# Altium schematic sheet INT_REG.SchDoc
size A; SheetNumber: 4; SheetTotal: 11
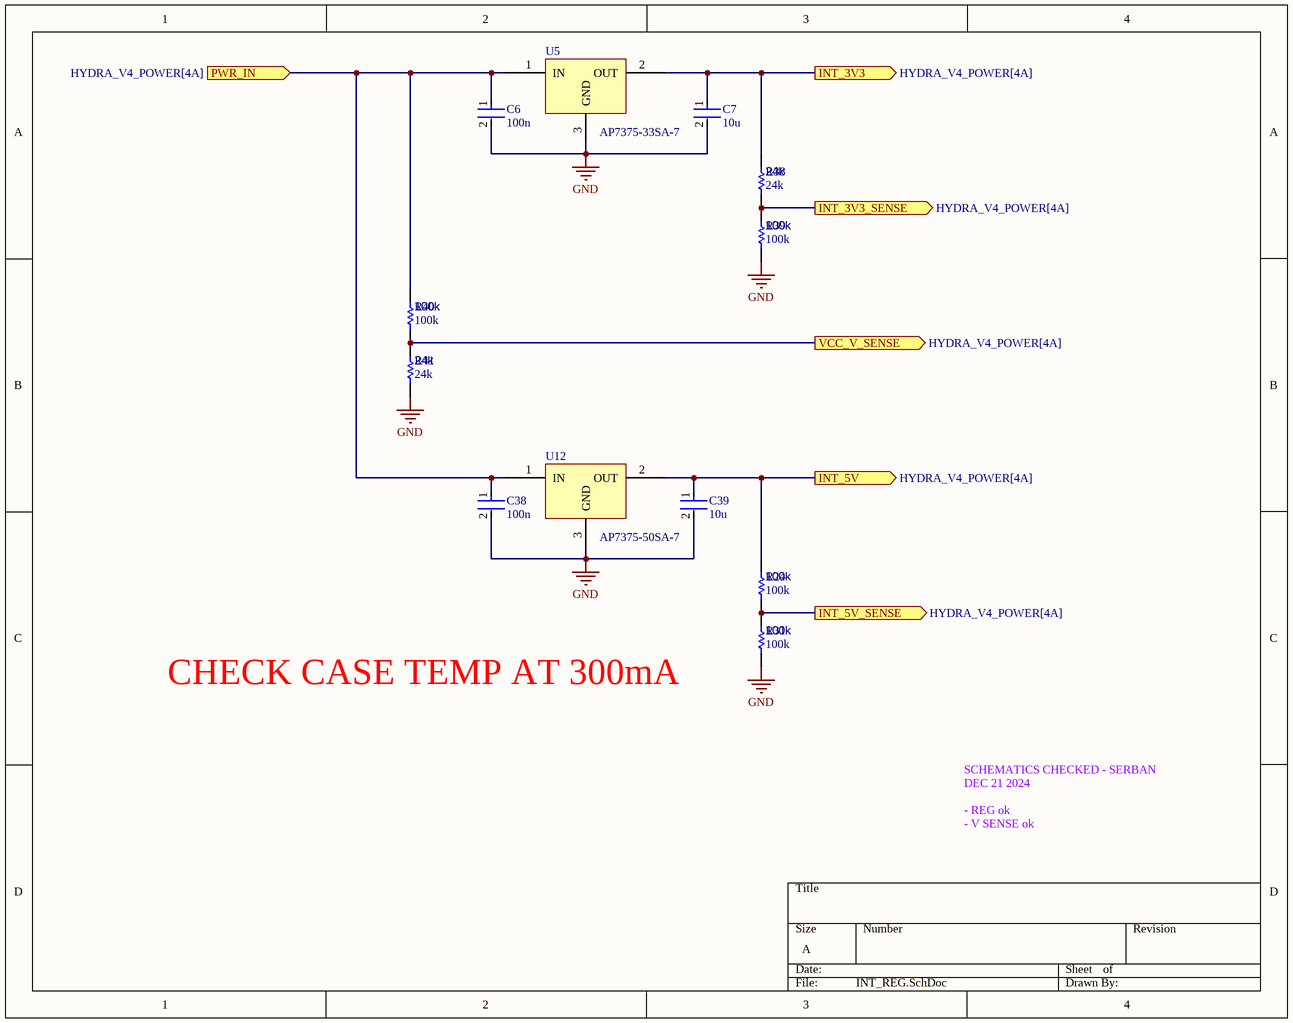
[diagram p0: INT_REG.SchDoc]

## Parts
C6  100n  [FP-0402-L_1_0_0_05-W_0_5-IPC_A]
C7  10u  [FP-0402-L_1_0_0_05-W_0_5-IPC_A]
C38  100n  [FP-0402-L_1_0_0_05-W_0_5-IPC_A]
C39  10u  [FP-0402-L_1_0_0_05-W_0_5-IPC_A]
R24  100k  [R0603B]
R31  100k  [R0603B]
R38  24k  [R0603B]
R39  100k  [R0603B]
R40  100k  [R0603B]
R41  24k  [R0603B]
U5  AP7375-33SA-7  [SOT90P285X110-3N]
U12  AP7375-50SA-7  [AP7375-50SA-7-Footprint-1]

## Ports
INT_3V3 (out, see HYDRA_V4_POWER[4A]), INT_3V3_SENSE (out, see HYDRA_V4_POWER[4A]), INT_5V (out, see HYDRA_V4_POWER[4A]), INT_5V_SENSE (out, see HYDRA_V4_POWER[4A]), PWR_IN (in, see HYDRA_V4_POWER[4A]), VCC_V_SENSE (out, see HYDRA_V4_POWER[4A])

## Nets
GND: C6.2 C7.2 C38.2 C39.2 R31.1 R39.1 R41.1 U5.3(GND) U12.3(GND)
INT_3V3: C7.1 R38.2 U5.2(OUT) ; port INT_3V3
INT_3V3_SENSE: R38.1 R39.2 ; port INT_3V3_SENSE
INT_5V: C39.1 R24.2 U12.2(OUT) ; port INT_5V
INT_5V_SENSE: R24.1 R31.2 ; port INT_5V_SENSE
PWR_IN: C6.1 C38.1 R40.2 U5.1(IN) U12.1(IN) ; port PWR_IN
VCC_V_SENSE: R40.1 R41.2 ; port VCC_V_SENSE

## Notes on the sheet
- CHECK CASE TEMP AT 300mA
- SCHEMATICS CHECKED - SERBAN
  DEC 21 2024
  - REG ok
  - V SENSE ok

## Library data of the parts
C6 C7 C38 C39 = CMP-001-00058-1: LARGE PADS, 0402 CAP, CHANGE COMMENT TO MATCH REAL P/N; Capacitor Type: Ceramic; Min Operating Temperature: -55°C; Mounting Technology: Surface Mount; Pins: 2; Case/Package: 0402; RoHS Compliant: Yes; Max Operating Temperature: 85°C
  C6 C38: Value: 100n
  C7 C39: Value: 10u
R24 R31 R38-R41 = CMP-009-00002-14: Resistor
  R24 R31 R39 R40: Value: 100k
  R38 R41: Value: 24k
U5 = CMP-019-00039-1: LDO Regulator Pos 3.3V 0.3A 3-Pin SOT-23 T/R
U12 = CMP-019-00041-1: Ldo Cmos Lowcurr SOT23 T&r 3K